# EasyEDA Pro project ESP32C3_Motor_MainControl.eprj, schematic ESP32C3RLogo
Create Date: 2023-12-13; Page Name: ESP32C3RLogo; Project Name: ESP32C3PowerKey; Schematic Name: ESP32C3RLogo; Update Date: 2023-12-13; Company: SEU; Drawed: 程浩; Page Size: A4; Version: V1.0
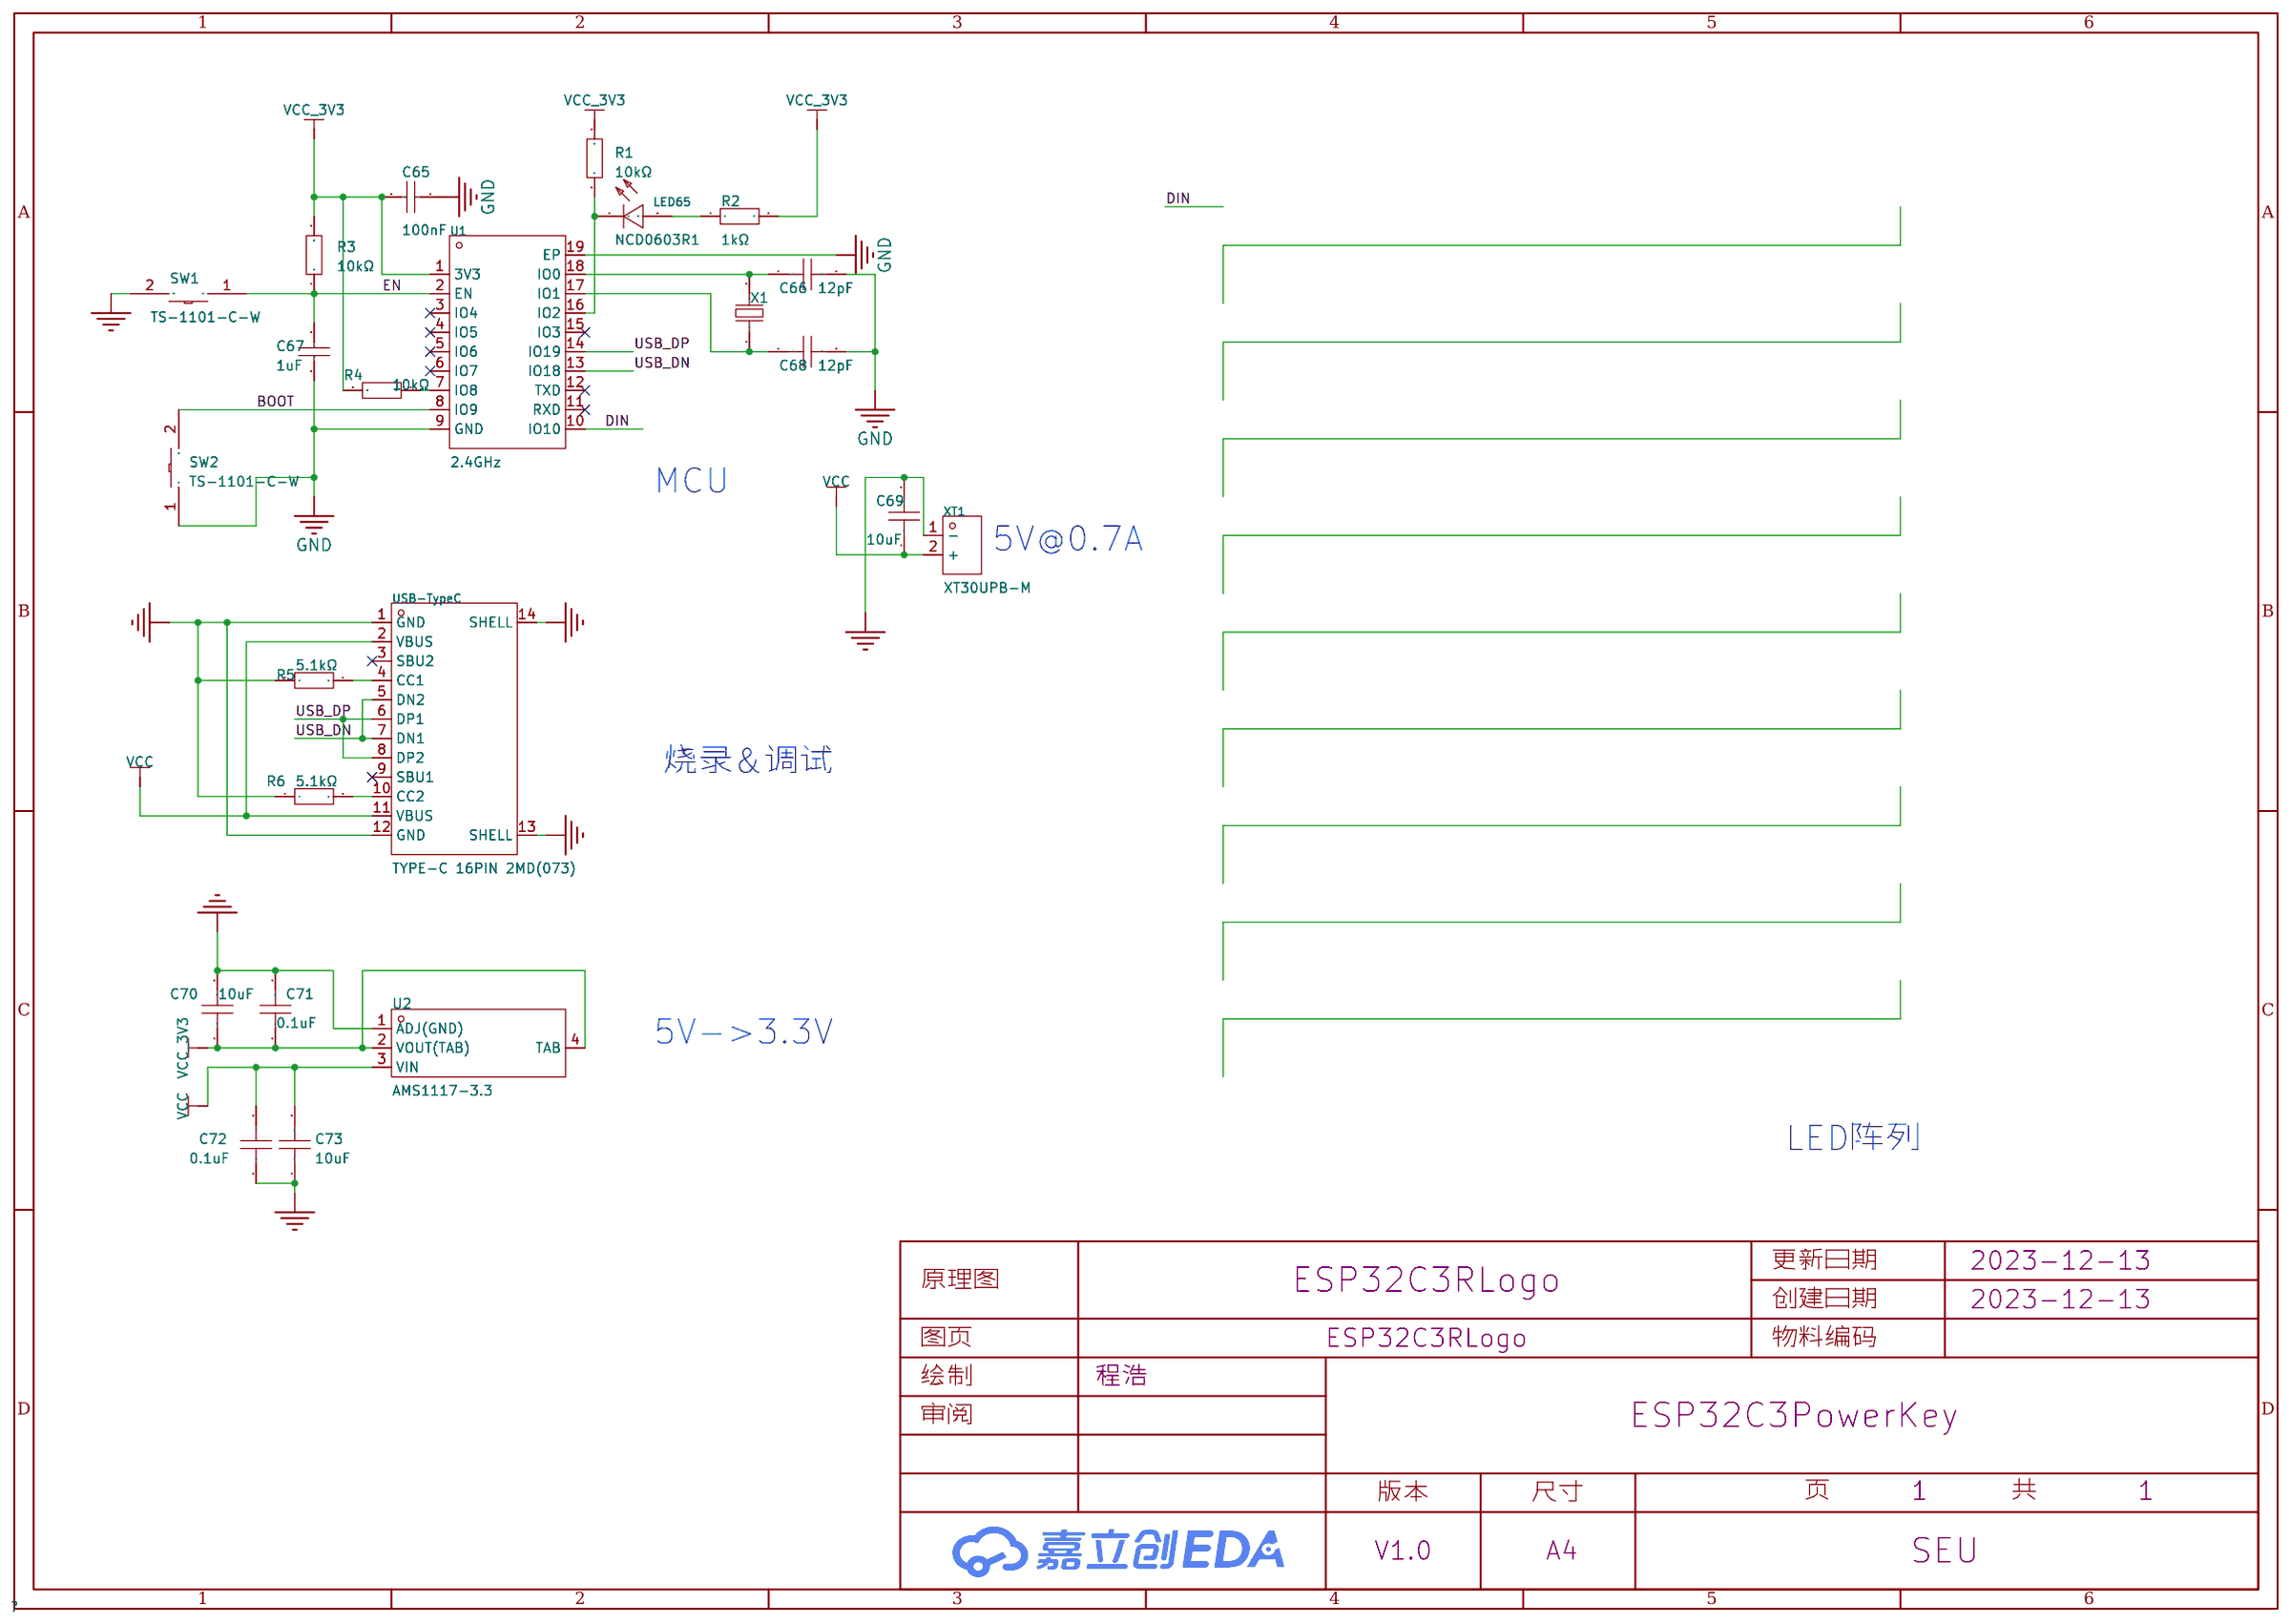
[diagram p1: schematic sheet]

## Parts
C65  100nF  [C0603]
C66  12pF  [C0603]
C67  1uF  [C0603]
C68  12pF  [C0603]
C69  10uF  [C0603]
C70  10uF  [C0603]
C71  0.1uF  [C0603]
C72  0.1uF  [C0603]
C73  10uF  [C0603]
CBB1  -
CBB2  -
CBB3  -
CBB4  -
CBB5  -
CBB6  -
CBB7  -
CBB8  -
CBB9  -
CBB10  -
CBB11  -
CBB12  -
CBB13  -
CBB14  -
CBB15  -
CBB16  -
CBB17  -
CBB18  -
CBB19  -
CBB20  -
CBB21  -
CBB22  -
CBB23  -
CBB24  -
CBB25  -
CBB26  -
CBB27  -
CBB28  -
CBB29  -
CBB30  -
CBB31  -
CBB32  -
CBB33  -
CBB34  -
CBB35  -
CBB36  -
CBB37  -
CBB38  -
CBB39  -
CBB40  -
CBB41  -
CBB42  -
CBB43  -
CBB44  -
CBB45  -
CBB46  -
CBB47  -
CBB48  -
CBB49  -
LED65  NCD0603R1  [LED0603-RD_RED]
R1  10kΩ  [R0603]
R2  1kΩ  [R0603]
R3  10kΩ  [R0603]
R4  10kΩ  [R0603]
R5  5.1kΩ  [R0603]
R6  5.1kΩ  [R0603]
SW1  TS-1101-C-W  [SW-SMD_L6.0-W3.3-LS8.0]
SW2  TS-1101-C-W  [SW-SMD_L6.0-W3.3-LS8.0]
U1  2.4GHz  [BULETM-SMD_ESPRESSIF_ESP32-C3-WROOM-02-N4-4MB]
U2  AMS1117-3.3  [SOT-223-4_L6.5-W3.5-P2.30-LS7.0-BR]
USB-TypeC  TYPE-C 16PIN 2MD(073)  [USB-C-SMD_TYPE-C-6PIN-2MD-073]
X1  32.768kHz  [FC-135R_L3.2-W1.5]
XT1  XT30UPB-M  [CONN-TH_XT30UPB-M]

## Library data of the parts
C65 = CC0603KRX7R9BB104: 容值:100nF;精度:±10%;额定电压:50V;材质(温度系数):X7R;; LCSC Part Name: 100nF ±10% 50V; Supplier Part: C14663; Manufacturer: YAGEO(国巨); Supplier Footprint: 0603; JLCPCB Part Class: Basic Part; Datasheet: https://atta.szlcsc.com/upload/public/pdf/source/20180910/C282072_33301C7F631E79921B82A8DAC6BCC5B3.pdf; Supplier: LCSC; Tolerance: ±10%; Voltage Rated: 50V; Temperature Coefficient: X7R
C66 C68 = CL10C120JB8NNNC: 容值:12pF;精度:±5%;额定电压:50V;材质(温度系数):C0G;; LCSC Part Name: 12pF ±5% 50V; Supplier Part: C38523; Manufacturer: SAMSUNG(三星); Supplier Footprint: 0603; JLCPCB Part Class: Basic Part; Datasheet: https://atta.szlcsc.com/upload/public/pdf/source/20160218/1457707763339.pdf; Supplier: LCSC; Tolerance: ±5%; Voltage Rated: 50V; Temperature Coefficient: C0G
C67 = CL10A105KA8NNNC: 容值:1uF;精度:±10%;额定电压:25V;温度系数:X5R;; LCSC Part Name: 1uF±10%25V; Supplier Part: C5673; Manufacturer: SAMSUNG(三星); Supplier Footprint: 0603; JLCPCB Part Class: ExtendedPart; Datasheet: https://atta.szlcsc.com/upload/public/pdf/source/20160103/1457707739994.pdf; Supplier: LCSC; Tolerance: ±10%; Voltage Rated: 25V; Temperature Coefficient: X5R
C69-C73 = CAP_0603: Supplier Footprint: 0603
LED65 = NCD0603R1_C84263: 发光颜色:红灯;; LCSC Part Name: 红灯 0603红灯   正贴; Supplier Part: C84263; Manufacturer: 国星光电; Supplier Footprint: 0603; JLCPCB Part Class: 扩展库; Datasheet: https://atta.szlcsc.com/upload/public/pdf/source/20200820/C84263_DABC6A75E58F576973B407FDBA283D60.pdf; Supplier: LCSC; Emitted Color: 红灯
R1 R3 R4 = 0603WAF1002T5E: 电阻类型:厚膜电阻;阻值:10kΩ;精度:±1%;功率:100mW;; LCSC Part Name: 厚膜电阻 10kΩ ±1% 100mW; Supplier Part: C25804; Manufacturer: UNI-ROYAL(厚声); Supplier Footprint: 0603; JLCPCB Part Class: Basic Part; Datasheet: https://atta.szlcsc.com/upload/public/pdf/source/20200306/C422600_1E6D84923E4A46A82E41ADD87F860B5C.pdf; Supplier: LCSC; Type: 厚膜电阻; Tolerance: ±1%; Power(Watts): 100mW; Temperature Coefficient: ±100ppm/℃; Overload Voltage (Max): 75V; Operating Temperature Range: -55℃~+155℃
R2 = 0603WAF1001T5E: 电阻类型:厚膜电阻;阻值:1kΩ;精度:±1%;功率:100mW;温度系数:±100ppm/℃;; LCSC Part Name: 厚膜电阻 1kΩ ±1% 100mW; Supplier Part: C21190; Manufacturer: UNI-ROYAL(厚声); Supplier Footprint: 0603; JLCPCB Part Class: Basic Part; Datasheet: https://atta.szlcsc.com/upload/public/pdf/source/20200306/C422600_1E6D84923E4A46A82E41ADD87F860B5C.pdf; Supplier: LCSC; Type: 厚膜电阻; Tolerance: ±1%; Power(Watts): 100mW; Temperature Coefficient: ±100ppm/℃; Overload Voltage (Max): 75V; Operating Temperature Range: -55℃~+155℃
R5 R6 = 0603WAF5101T5E: 电阻类型:厚膜电阻;阻值:5.1kΩ;精度:±1%;功率:100mW;; LCSC Part Name: 5.1kΩ ±1% 100mW; Supplier Part: C23186; Manufacturer: UNI-ROYAL(厚声); Supplier Footprint: 0603; JLCPCB Part Class: Basic Part; Datasheet: https://atta.szlcsc.com/upload/public/pdf/source/20200306/C422600_1E6D84923E4A46A82E41ADD87F860B5C.pdf; Supplier: LCSC; Type: 厚膜电阻; Tolerance: ±1%; Power(Watts): 100mW; Temperature Coefficient: ±100ppm/℃; Overload Voltage (Max): 75V; Operating Temperature Range: -55℃~+155℃
SW1 SW2 = TS-1101-C-W: 触点电流:50mA;额定电压(AC):-;额定电压(DC):12V;额定功率:-;绝缘电阻:-;电路结构:单刀单掷;安装方式:立贴;带灯:无;作用力:260gf;机械寿命:5万次;带支架:否;; LCSC Part Name: 立贴 6*3.6*2.5mm 轻触开关 一型3*6*2.5有白ZD b拉伸白色带淡绿按键 卷装; Supplier Part: C318938; Manufacturer: XKB Connectivity(中国星坤); Supplier Footprint: SMD; JLCPCB Part Class: Extended Part; Datasheet: https://atta.szlcsc.com/upload/public/pdf/source/20200227/C318938_C2E53B1EEDE37D980A33616AC086DE53.pdf; Supplier: LCSC; Contact Current: 50mA; Voltage Rating (DC): 12V; Circuit: 单刀单掷; Mounting Style: 立贴; Actuator Style: 矩形按钮; Actuator/Cap Color: 白色带淡绿; With Lamp: 无; Operating Force: 260gf; Mechanical Life: 5万次; Operating Temperature: -30℃~+85℃; Switch Length: 6mm; Switch Width: 3.6mm; Switch Height: 2.5mm; Strike Gundam: 否
U1 = ESP32-C3-WROOM-02-N4: 频率:2.4GHz;发射功率:20.5dBm;核心处理器:ESP32-C3;; Supplier Part: C2934560; Manufacturer: ESPRESSIF(乐鑫); Supplier Footprint: VFQFN-32-EP; JLCPCB Part Class: Extended Part; Datasheet: https://atta.szlcsc.com/upload/public/pdf/source/20220106/F07459EFFE1D7CBA94B4FB8A075146A6.pdf; Supplier: LCSC; Core Processor: ESP32-C3; Support Interface: I2C；GPIO；SPI；JTAG；UART；USB；I2S; Output Power: 20.5dBm
U2 = AMS1117-3.3_C347222: 输出类型:固定;输出极性:正;最大输入电压:18V;输出电压:3.3V;输出电流:1A;电源纹波抑制比(PSRR):60dB@(120Hz);; Supplier Part: C347222; Manufacturer: UMW(广东友台半导体); Supplier Footprint: SOT-223; JLCPCB Part Class: 扩展库; Datasheet: https://atta.szlcsc.com/upload/public/pdf/source/20211011/50CC665C22E3A66C08379A4A74BDA25C.pdf; Supplier: LCSC; Output Type: 固定; Output Polarity: 正; Number of Outputs: 1; Maximum Input Voltage: 18V; Output Voltage: 3.3V; Dropout Voltage: 1.3V@(1A); Output Current: 1A; Power Supply Rejection Ratio (PSRR): 60dB@(120Hz)
USB-TypeC = TYPE-C 16PIN 2MD(073): 连接器类型:Type-C;标准:-;公母:母座;触点数量:16;端口数量:1;安装方式:卧贴;额定电流 - 电源:5A;工作温度范围:-25℃~+85℃;; LCSC Part Name: TYPE-C母座 16P 4脚插件带定位柱 不锈钢外壳 2次模顶; Supplier Part: C2765186; Manufacturer: SHOU HAN(首韩); Supplier Footprint: SMD; JLCPCB Part Class: 扩展库; Supplier: LCSC; Connector Type: Type-C; Gender: 母座; Number of Contacts: 16; Number of Ports: 1; Mounting Style: 卧贴; Current Rating - Power (Max): 5A; Operating Temperature Range: -25℃~+85℃
X1 = Q13FC1350000400: 频率:32.768kHz;频率公差:±20ppm;负载电容:12.5pF;; LCSC Part Name: 32.768kHz ±20ppm 12.5pF; Supplier Part: C32346; Manufacturer: EPSON(爱普生); Supplier Footprint: SMD3215-2P; JLCPCB Part Class: Basic Part; Datasheet: https://atta.szlcsc.com/upload/public/pdf/source/20190108/C32346_746D6B07EAF90824457A96480007685F.pdf; Supplier: LCSC; Crystal Type: 贴片无源晶振; Frequency Tolerance: ±20ppm; Load Capacitance: 12.5pF; Equivalent Series Resistance (ESR): 70kΩ; Operating Temperature: -40℃~+85℃
XT1 = XT30UPB-M: 类别:-;类型1:-;; LCSC Part Name: AMASS(艾迈斯)板载立式 航模锂电池控制器连接器插头 公头XT30UPB-M; Supplier Part: C428721; Manufacturer: AMASS(艾迈斯); JLCPCB Part Class: 扩展库; Datasheet: https://atta.szlcsc.com/upload/public/pdf/source/20230412/7B5DFEF57C9EA5273853390C734B3AC5.pdf; Supplier: LCSC; Brand: 艾迈斯; Type: 航模插头; Colour: 黄色; RatedVoltage: DC 500V; InterfaceType: 公头; MetalMaterial: 镀金; InsulationMaterial: PA; RatedCurrent: 15A; contact resistance: 0.65mΩ

## Nets
GND: C65.1 C66.2 C67.1 C68.2 C69.2 C70.2 C71.1 C72.2 C73.1 R5.1 R6.1 SW1.2 SW2.1 U1.9(GND) U1.19(EP) U2.1(ADJ(GND)) USB-TypeC.1(GND) USB-TypeC.12(GND) USB-TypeC.13(SHELL) USB-TypeC.14(SHELL) XT1.1(-)
VCC: C69.1 C72.1 C73.2 U2.3(VIN) USB-TypeC.2(VBUS) USB-TypeC.11(VBUS) XT1.2(+)
VCC_3V3: C65.2 C70.1 C71.2 R1.1 R2.2 R3.2 R4.2 U1.1(3V3) U2.2(VOUT(TAB)) U2.4(TAB)
BOOT: SW2.2 U1.8(IO9)
DIN: CBB1.1(DI) U1.10(IO10)
EN: C67.2 R3.1 SW1.1 U1.2(EN)
USB_DN: U1.13(IO18) USB-TypeC.5(DN2) USB-TypeC.7(DN1)
USB_DP: U1.14(IO19) USB-TypeC.6(DP1) USB-TypeC.8(DP2)
$1N818: C66.1 U1.18(IO0) X1.2
$1N819: C68.1 U1.17(IO1) X1.1
$1N821: R4.1 U1.7(IO8)
$1N839: LED65.1(K) R1.2 U1.16(IO2)
$1N846: LED65.2(A) R2.1
$1N1163: R5.2 USB-TypeC.4(CC1)
$1N1164: R6.2 USB-TypeC.10(CC2)
Net-(CBB1-2): CBB1.2(DO) CBB2.1(DI)
Net-(CBB2-2): CBB2.2(DO) CBB3.1(DI)
Net-(CBB3-2): CBB3.2(DO) CBB4.1(DI)
Net-(CBB4-2): CBB4.2(DO) CBB5.1(DI)
Net-(CBB5-2): CBB5.2(DO) CBB6.1(DI)
Net-(CBB6-2): CBB6.2(DO) CBB7.1(DI)
Net-(CBB7-2): CBB7.2(DO) CBB8.1(DI)
Net-(CBB8-2): CBB8.2(DO) CBB9.1(DI)
Net-(CBB9-2): CBB9.2(DO) CBB10.1(DI)
Net-(CBB10-2): CBB10.2(DO) CBB11.1(DI)
Net-(CBB11-2): CBB11.2(DO) CBB12.1(DI)
Net-(CBB12-2): CBB12.2(DO) CBB13.1(DI)
Net-(CBB13-2): CBB13.2(DO) CBB14.1(DI)
Net-(CBB14-2): CBB14.2(DO) CBB15.1(DI)
Net-(CBB15-2): CBB15.2(DO) CBB16.1(DI)
Net-(CBB16-2): CBB16.2(DO) CBB17.1(DI)
Net-(CBB17-2): CBB17.2(DO) CBB18.1(DI)
Net-(CBB18-2): CBB18.2(DO) CBB19.1(DI)
Net-(CBB19-2): CBB19.2(DO) CBB20.1(DI)
Net-(CBB20-2): CBB20.2(DO) CBB21.1(DI)
Net-(CBB21-2): CBB21.2(DO) CBB22.1(DI)
Net-(CBB22-2): CBB22.2(DO) CBB23.1(DI)
Net-(CBB23-2): CBB23.2(DO) CBB24.1(DI)
Net-(CBB24-2): CBB24.2(DO) CBB25.1(DI)
Net-(CBB25-2): CBB25.2(DO) CBB26.1(DI)
Net-(CBB26-2): CBB26.2(DO) CBB27.1(DI)
Net-(CBB27-2): CBB27.2(DO) CBB28.1(DI)
Net-(CBB28-2): CBB28.2(DO) CBB29.1(DI)
Net-(CBB29-2): CBB29.2(DO) CBB30.1(DI)
Net-(CBB30-2): CBB30.2(DO) CBB31.1(DI)
Net-(CBB31-2): CBB31.2(DO) CBB32.1(DI)
Net-(CBB32-2): CBB32.2(DO) CBB33.1(DI)
Net-(CBB33-2): CBB33.2(DO) CBB34.1(DI)
Net-(CBB34-2): CBB34.2(DO) CBB35.1(DI)
Net-(CBB35-2): CBB35.2(DO) CBB36.1(DI)
Net-(CBB36-2): CBB36.2(DO) CBB37.1(DI)
Net-(CBB37-2): CBB37.2(DO) CBB38.1(DI)
Net-(CBB38-2): CBB38.2(DO) CBB39.1(DI)
Net-(CBB39-2): CBB39.2(DO) CBB40.1(DI)
Net-(CBB40-2): CBB40.2(DO) CBB41.1(DI)
Net-(CBB41-2): CBB41.2(DO) CBB42.1(DI)
Net-(CBB42-2): CBB42.2(DO) CBB43.1(DI)
Net-(CBB43-2): CBB43.2(DO) CBB44.1(DI)
Net-(CBB44-2): CBB44.2(DO) CBB45.1(DI)
Net-(CBB45-2): CBB45.2(DO) CBB46.1(DI)
Net-(CBB46-2): CBB46.2(DO) CBB47.1(DI)
Net-(CBB47-2): CBB47.2(DO) CBB48.1(DI)
Net-(CBB48-2): CBB48.2(DO) CBB49.1(DI)

Not connected (* = marked no-connect by the designer): CBB49 2(DO); U1 3(IO4)* 4(IO5)* 5(IO6)* 6(IO7)* 11(RXD)* 12(TXD)* 15(IO3)*; USB-TypeC 3(SBU2)* 9(SBU1)*

## Notes on the sheet
- MCU
- 5V@0.7A
- 烧录&调试
- 5V->3.3V
- LED阵列
